# EAGLE design powersupply_r0 (EAGLE 6.5.0)
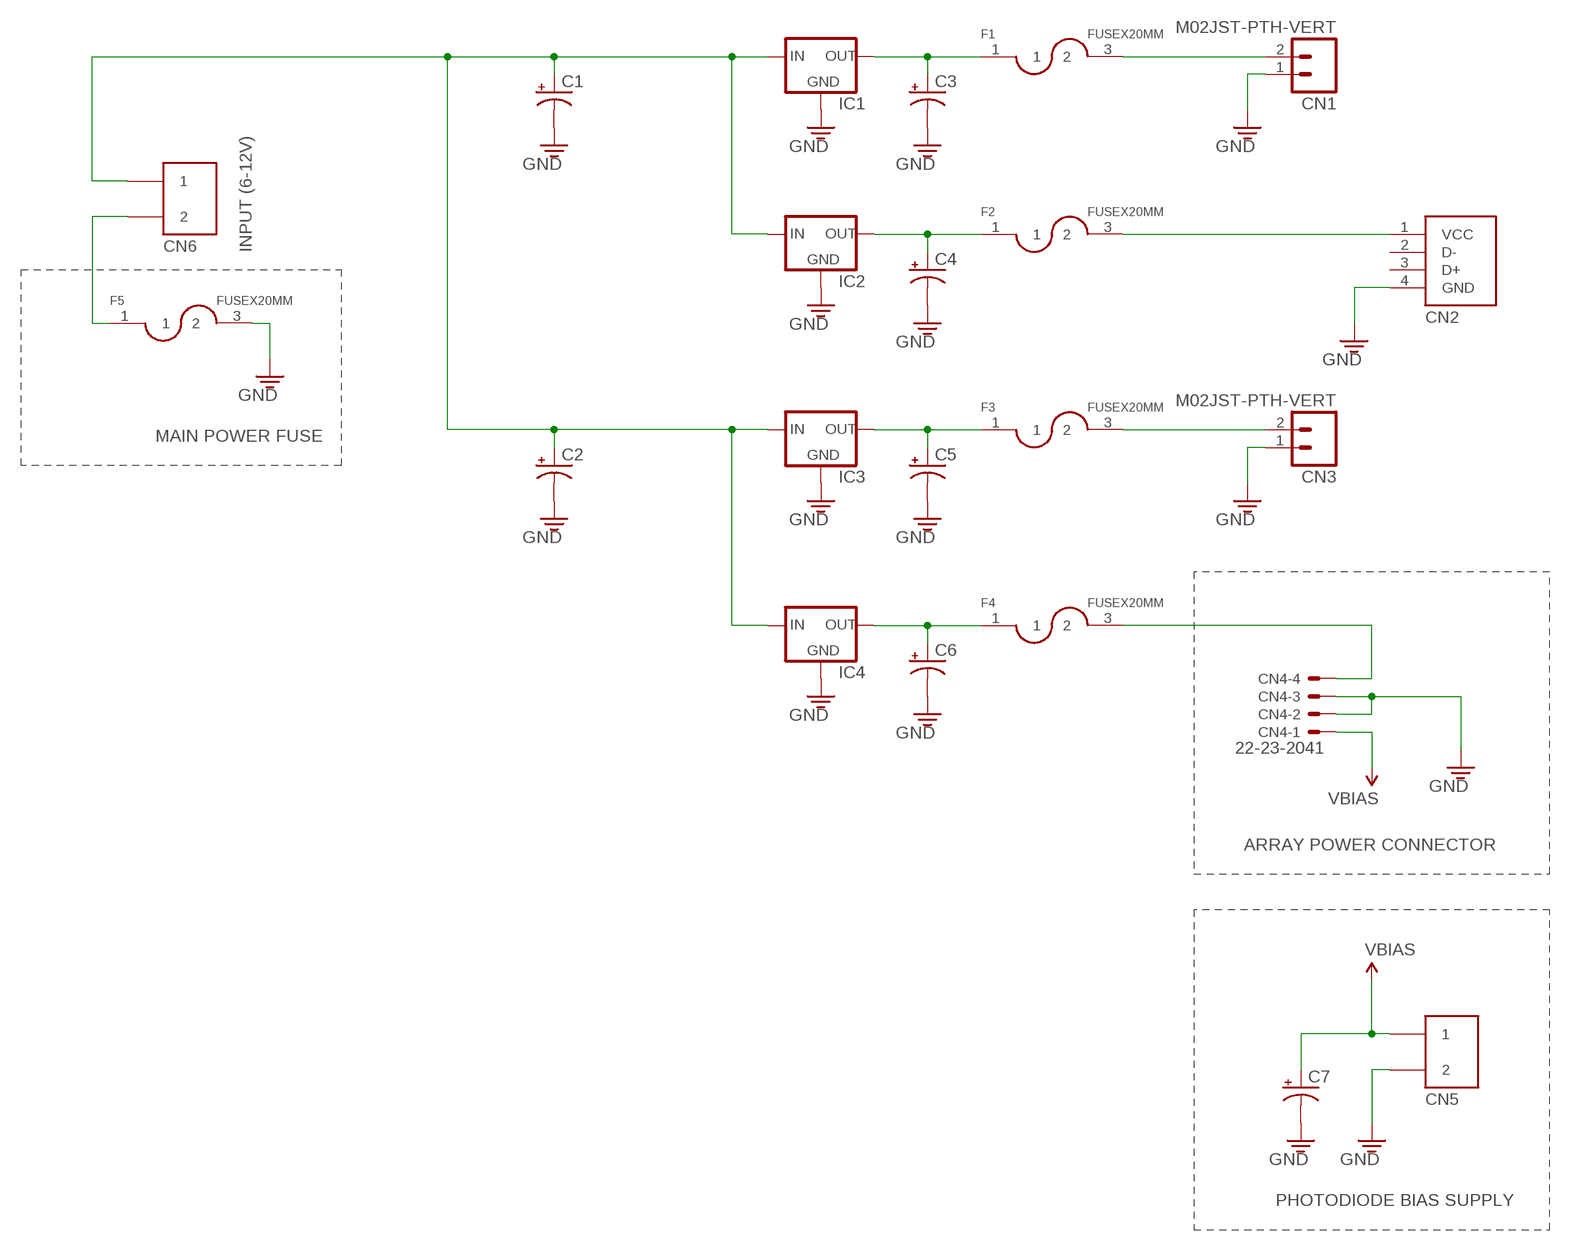
[diagram p0: schematic, sheet 1]

## Parts
C1  CAP_POLPTH4  [CPOL-RADIAL-1000UF-25V]
C2  CAP_POLPTH4  [CPOL-RADIAL-1000UF-25V]
C3  CAP_POLPTH1  [CPOL-RADIAL-100UF-25V]
C4  CAP_POLPTH1  [CPOL-RADIAL-100UF-25V]
C5  CAP_POLPTH1  [CPOL-RADIAL-100UF-25V]
C6  CAP_POLPTH1  [CPOL-RADIAL-100UF-25V]
C7  CAP_POLPTH1  [CPOL-RADIAL-100UF-25V]
CN1  M02JST-PTH-VERT  [JST-2-PTH-VERT]
CN2  CON-USB  [MOLEX-USB-105057-0001]
CN3  M02JST-PTH-VERT  [JST-2-PTH-VERT]
CN4  22-23-2041  [22-23-2041]
CN5  SCREWTERMINAL-2PIN  [SCREWTERMINAL-2PIN]
CN6  SCREWTERMINAL-2PIN  [SCREWTERMINAL-2PIN]
F1  FUSEX20MM  [FUSE_5MM]
F2  FUSEX20MM  [FUSE_5MM]
F3  FUSEX20MM  [FUSE_5MM]
F4  FUSEX20MM  [FUSE_5MM]
F5  FUSEX20MM  [FUSE_5MM]
IC1  V_REG_78XXSINK  [TO220-IGO]
IC2  V_REG_78XXSINK  [TO220-IGO]
IC3  V_REG_78XXSINK  [TO220-IGO]
IC4  V_REG_78XXSINK  [TO220-IGO]

## Nets
GND: C1.2(-) C2.2(-) C3.2(-) C4.2(-) C5.2(-) C6.2(-) C7.2(-) CN1.1 CN2.4(GND) CN3.1 CN4.2 CN4.3 CN5.2 F5.3 IC1.GND IC2.GND IC3.GND IC4.GND
N$1: C3.1(+) F1.1 IC1.OUT
N$2: C4.1(+) F2.1 IC2.OUT
N$3: C5.1(+) F3.1 IC3.OUT
N$4: C6.1(+) F4.1 IC4.OUT
N$5: CN4.4 F4.3
N$7: CN6.2 F5.1
N$8: CN1.2 F1.3
N$9: CN2.1(VCC) F2.3
N$10: CN3.2 F3.3
N$11: C1.1(+) C2.1(+) CN6.1 IC1.IN IC2.IN IC3.IN IC4.IN
VBIAS: C7.1(+) CN4.1 CN5.1
Unconnected: CN2.2(D-) CN2.3(D+)

## Notes on the sheet
- INPUT (6-12V)
- MAIN POWER FUSE
- ARRAY POWER CONNECTOR
- PHOTODIODE BIAS SUPPLY

## Library data of the parts
C1-C7 = SparkFun-Passives:CAP_POL: Capacitor Polarized These are standard SMD and PTH capacitors. Normally 10uF, 47uF, and 100uF in electrolytic and tantalum varieties. Always verify the external diameter of the through hole cap, it varies with capacity, voltage, and manufacturer. The EIA devices should be standard.
CN1 CN3 = SparkFun-Connectors:M02: Standard 2-pin 0.1" header. Use with - straight break away headers ( PRT-00116) - right angle break away headers (PRT-00553) - swiss pins (PRT-00743) - machine pins (PRT-00117) - female headers (PRT-00115) Molex polarized connector foot print use with: PRT-08233 with associated crimp pins and housings. 2.54_SCREWTERM for use with PRT-10571. 3.5mm Screw Terminal footprints for PRT-08084 5mm Screw Terminal footprints for use with PRT-08433
CN2 = openct:CON-USB
CN4 = con-molex:22-23-2041: .100" (2.54mm) Center Header - 4 Pin; MF: MOLEX; MPN: 22-23-2041; OC_FARNELL: 1462920; OC_NEWARK: 38C0355
CN5 CN6 = openct:SCREWTERMINAL-2PIN: 2-pin 5mm pitch screw terminal connector
F1-F5 = SparkFun-Passives:FUSE
IC1-IC4 = SparkFun-PowerIC:V_REG_78XX: Voltage Regulator Standard 7805 5V regulator. IGO (Input Ground Output). Spark Fun Electronics SKU : COM-00107

## Board
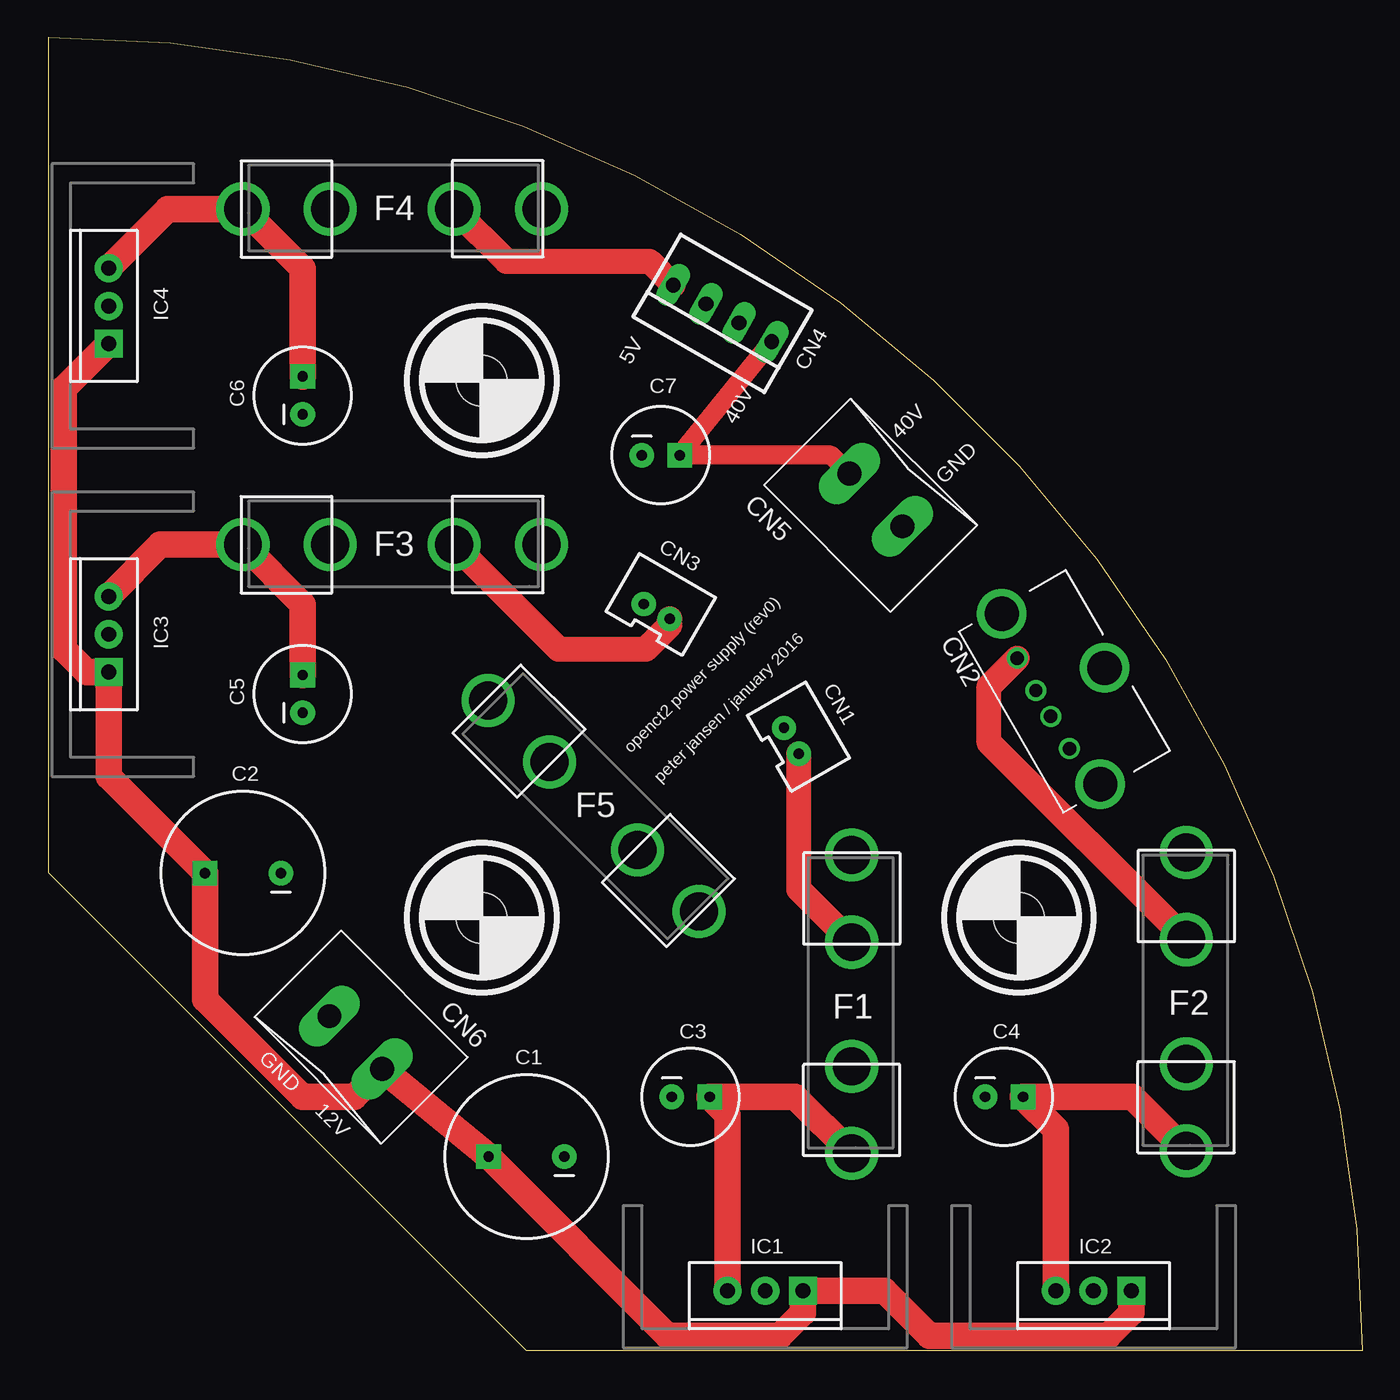
[diagram p1: board, top side]
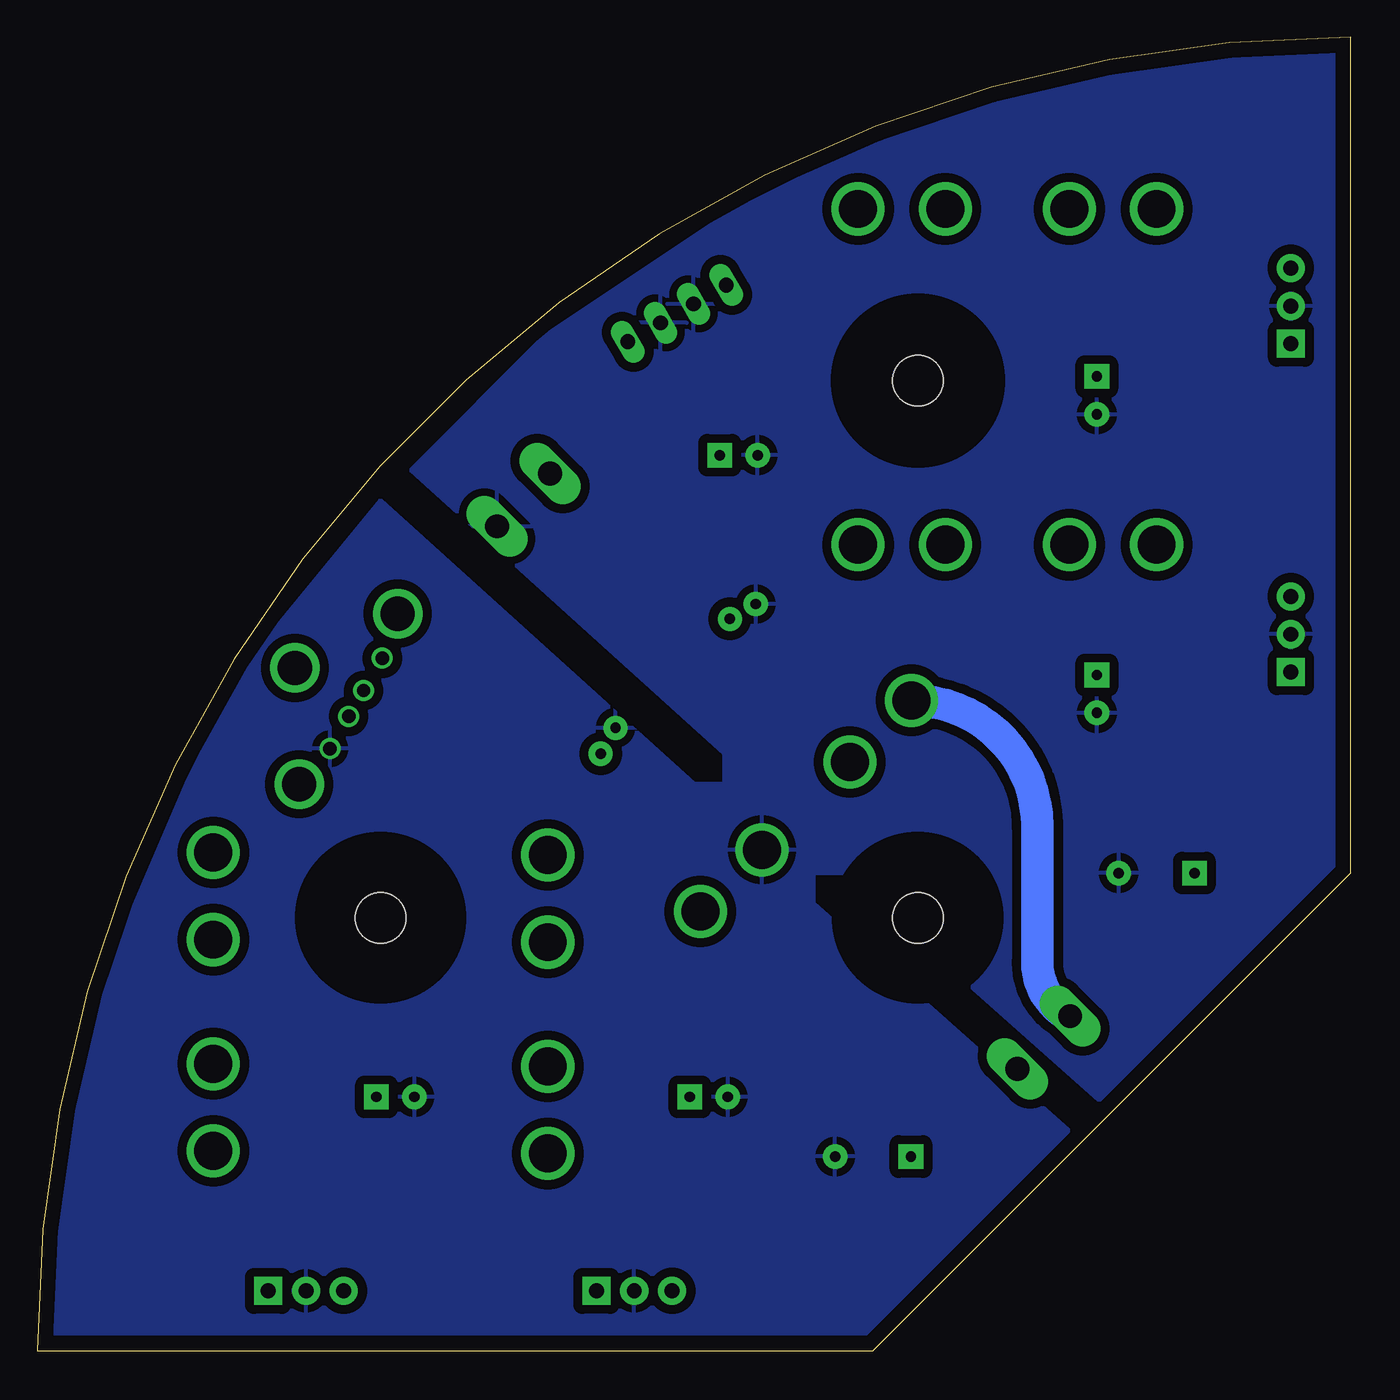
[diagram p2: board, bottom side, seen from below]

Size 88 x 88 mm. Coordinates in mm from the lower left corner, seen from the top.
Outline: 0,88 arc-90 88,0 32,0 0,32 0,88
Copper layers (1*16): Top 0.035mm / dielectric 1.5mm / Bottom 0.035mm
Design rules "default *": minimum track width 10mil, minimum drill 24mil, track to track 8mil, track to pad 8mil, pad to pad 8mil, via to via 8mil, smd to smd 8mil, copper to edge 40mil, drill to drill 8mil, minimum pad ring 10mil, minimum via ring 8mil, stop-mask expansion 4mil, vias tented up to drill 0mil, thermal gap 20mil
Holes 3.4 mm at 29,65 29,29 65,29
tRestrict: area 24,60 to 34,70; area 24,24 to 34,34; area 60,24 to 70,34
bRestrict: area 24,24 to 34,34; area 60,24 to 70,34; area 23.9,59.9 to 34.1,70.1

### Footprints (pad centres in the part's own frame; a part is rotated, then mirrored left to right if it is on the bottom)
CPOL-RADIAL-1000UF-25V = drill 0.7 pad 1.651 square: 1 2.54,0 | drill 0.7 pad 1.651: 2 -2.54,0
CPOL-RADIAL-100UF-25V = drill 0.7 pad 1.651 square: 1 1.27,0 | drill 0.7 pad 1.651: 2 -1.27,0
JST-2-PTH-VERT = drill 0.7 pad 1.626: 1 -1,-0.55; 2 1,-0.55
MOLEX-USB-105057-0001 = drill 0.9: 1 -3.5,0; 2 -1,0; 3 1,0; 4 3.5,0 | drill 2.3: M1 -6.6,0.6; M2 6.6,0.6; M3 0,4.75
22-23-2041 = drill 1 long: 1 -3.81,0; 2 -1.27,0; 3 1.27,0; 4 3.81,0
SCREWTERMINAL-2PIN = drill 1.6 long: 1 -2.5,0; 2 2.5,0
FUSE_5MM = drill 2.54 pad 3.556: 1 0,-10; 2 0,-4.158; 3 0,4.158; 4 0,10
TO220-IGO = drill 1 pad 1.88: GND 0,0; OUT 2.54,0 | drill 1 pad 1.88 square: IN -2.54,0

### Placement (x,y rotation side)
C1  32,13 180 top
C2  13,32 180 top
C3  43,17 0 top
C4  64,17 0 top
C5  17,44 90 top
C6  17,64 90 top
C7  41,60 0 top
CN1  50.23,41.13 300 top
CN2  66.63,43.37 300 top
CN3  41,50 330 top
CN4  45.13,69.5 150 top
CN5  55.41,57 315 top
CN6  20.56,20.65 135 top
F1  53.79,23.21 0 top
F2  76.21,23.38 0 top
F3  23,54 270 top
F4  23,76.5 270 top
F5  36.5,36.5 225 top
IC1  48,4 180 top
IC2  70,4 180 top
IC3  4,48 90 top
IC4  4,70 90 top

### Tracks (layer width: path | path; a pad name or v marks a point on that pad's centre or on a via)
GND
  pour Bottom (isolate 0.61): 0,88 14,86 30,82 42,76 54,68 63,59 42,40 42,36 38,32 34,32 16,16 0,32
  pour Bottom (isolate 0.61): 88,0 86,14 84,24 78,38 74,46 65,57 44,38 40,38 36,34 36,30 18,14 32,0
N$1
  Top 1.778: F1.1 50,17 C3.1 45.46,15.81 IC1.OUT
N$2
  Top 1.778: F2.1 72.59,17 C4.1 67.46,14.81 IC2.OUT
N$3
  Top 1.778: IC3.OUT 7.46,54 F3.1 17,50 C5.1
N$4
  Top 1.778: IC4.OUT 7.96,76.5 F4.1 17,72.5 C6.1
N$5
  Top 1.676: F4.3 30.66,73 40.24,73 CN4.4
N$7
  Bottom 2.184: F5.1 arc90 21,35.14 21,26 arc-63 CN6.2
N$8
  Top 1.676: F1.3 50.26,30.9 CN1.2
N$9
  Top 1.676: F2.3 63,40.74 63,44.51 CN2.1
N$10
  Top 1.676: F3.3 34.16,47 40,47 41.59,48.59 CN3.2
N$11
  Top 1.778: IC4.IN 1,64.46 1,47 2.54,45.46 IC3.IN 4,38.46 C2.1 10.46,23.54 17,17 20.45,17 CN6.1 C1.1 41.46,1 49,1 50.54,2.54 IC1.IN 56,4 59,1 71,1 72.54,2.54 IC2.IN
VBIAS
  Top 1.27: CN5.1 52.41,60 C7.1 CN4.1

### Text on the board
tPlace: F4 | IC4 | 5V | 40V | 40V | GND | F3 | IC3 | openct2 power supply (rev0) | peter jansen / january 2016 | F5 | F1 | F2 | GND | 12V | IC1 | IC2